# Altium schematic sheet Relay.SchDoc
size A4; Author: Van Hieu; Organization: BACH-KHOA-DK; SheetNumber: 5; SheetTotal: 6; Gmail: maivanhieu24042003@gmail.com
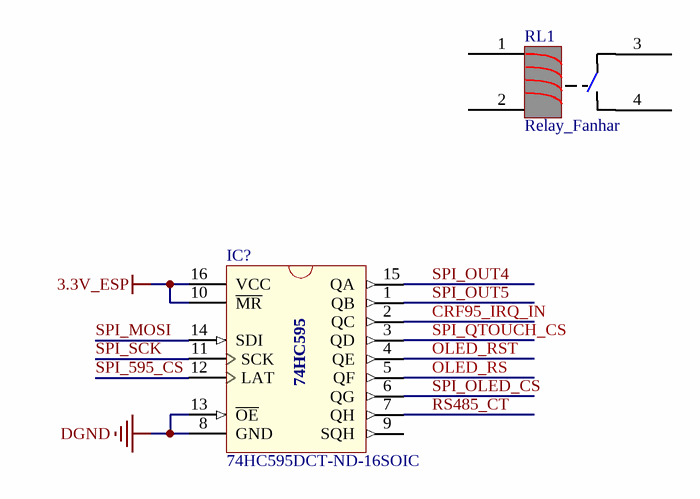
[diagram p0: Relay.SchDoc]

## Parts
IC?  74HC595DCT-ND-16SOIC  [DIP16/W0.3]
RL1  Relay_Fanhar  [Relay_Fanhar]

## Nets
3.3V_ESP: IC?.10(~{MR}) IC?.16(VCC)
DGND: IC?.8(GND) IC?.13(~{OE})
CRF95_IRQ_IN: IC?.2(QC)
OLED_RS: IC?.5(QF)
OLED_RST: IC?.4(QE)
RS485_CT: IC?.7(QH)
SPI_595_CS: IC?.12(LAT)
SPI_MOSI: IC?.14(SDI)
SPI_OLED_CS: IC?.6(QG)
SPI_OUT4: IC?.15(QA)
SPI_OUT5: IC?.1(QB)
SPI_QTOUCH_CS: IC?.3(QD)
SPI_SCK: IC?.11(SCK)

Not connected (* = marked no-connect by the designer): IC? 9(SQH); RL1 1(c) 2(c) 3(NO) 4(COM)

## Notes on the sheet
- Van Hieu
- Date:
- Size:
- A4
- Number:
- Time:
- Sheet
- Revision:
- of
- BK-DN
- File:
- maivanhieu24042003@gmail.com

## Library data of the parts
IC? = 74HC595: 8 Bit Serial input - Parallel Output; Value: 74HC595
RL1 = Relay_Fanhar: Fanhar-W11-1A2STLE-H / DC5V / Relay